# Altium schematic sheet DW1000BreakoutPeripherals.SchDoc: DecaWave DW1000
size A4; CompanyName: SPAN; Engineer: Anh Luong; Organization: University of Utah; Address1: 50 S Central Campus Dr; Address2: MEB Rm 3129; Address3: Salt Lake City, Utah 84115; Address4: USA; Revision: 1; SheetNumber: 2; SheetTotal: 2
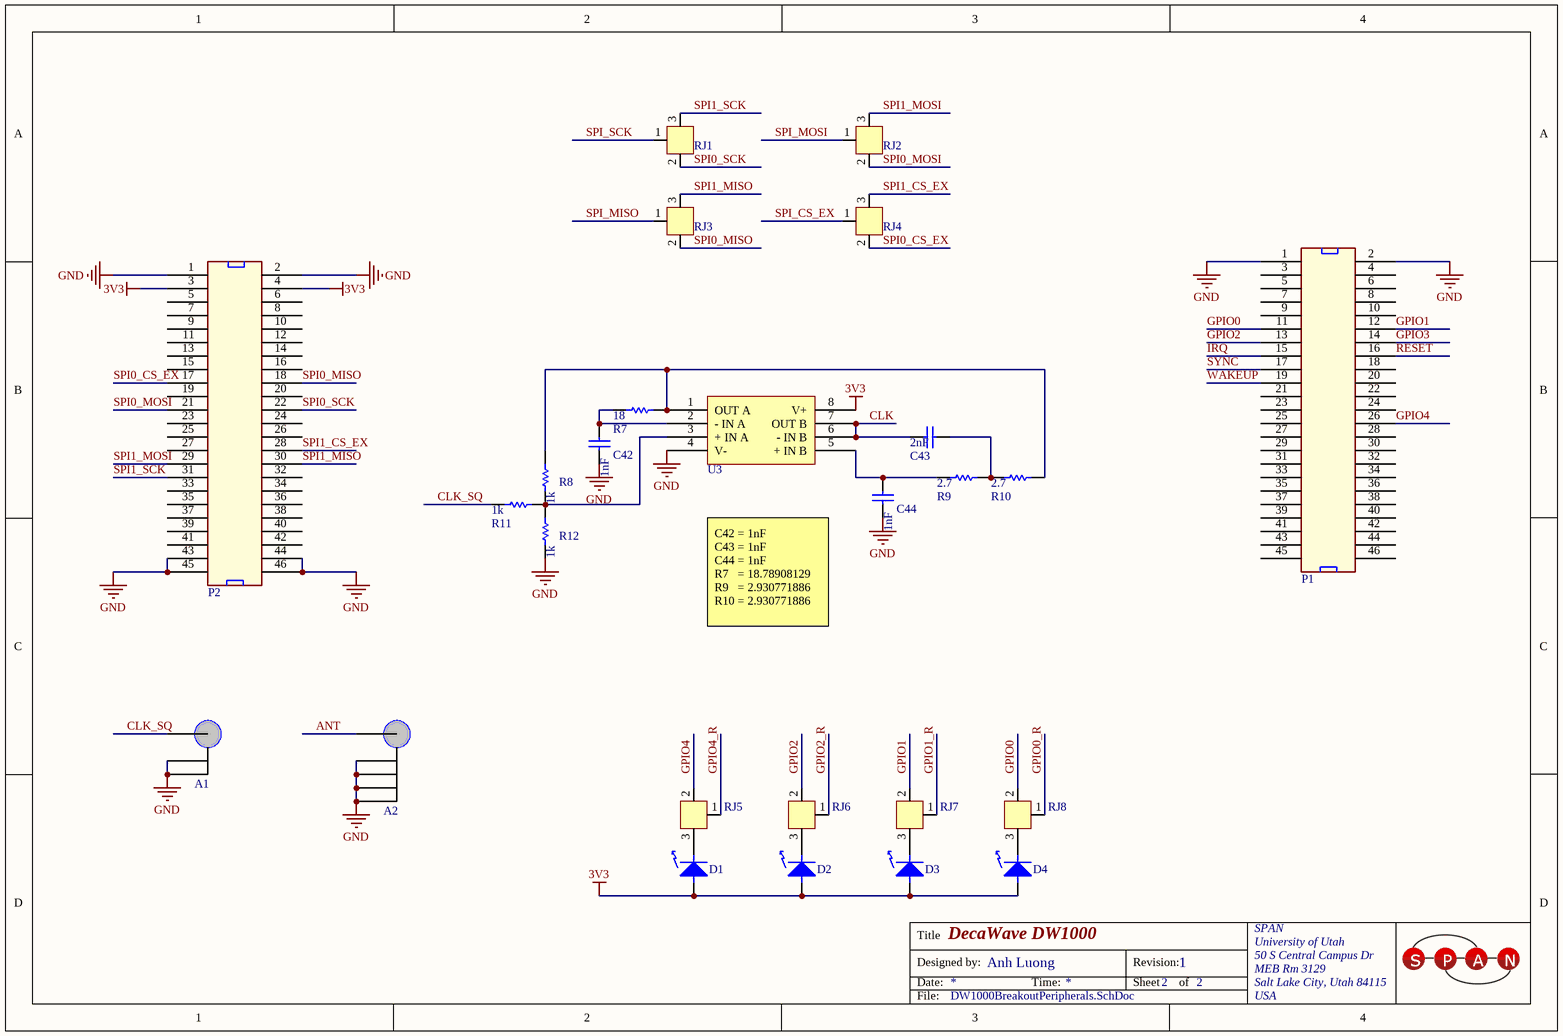
[diagram p0: DW1000BreakoutPeripherals.SchDoc]

## Parts
A1  U.FL-R-SMT(01)  [U.FL-R-SMT-1]  (value not drawn)
A2  CONSMA003.062  [SMA_EDGE_MNT]  (value not drawn)
C42  GRM033R71C102KA01D  [CAPC1608X08N (0603)]  (value not drawn)
C43  GRM1885C1H202JA01D  [CAPC1608X08N (0603)]  (value not drawn)
C44  GRM033R71C102KA01D  [CAPC1608X08N (0603)]  (value not drawn)
D1  LG Q971-KN-1  [CHIPLED0603]  (value not drawn)
D2  LG Q971-KN-1  [CHIPLED0603]  (value not drawn)
D3  LG Q971-KN-1  [CHIPLED0603]  (value not drawn)
D4  LG Q971-KN-1  [CHIPLED0603]  (value not drawn)
P1  PREC023DAAN-RC  [HEADER23X2]  (value not drawn)
P2  PREC023DAAN-RC  [HEADER23X2]  (value not drawn)
R7  MCR03ERTJ180  [RESC1608X06N (0603)]  (value not drawn)
R8  MCR03ERTJ102  [RESC1608X06N (0603)]  (value not drawn)
R9  MCR03ERTJ2R7  [RESC1608X06N (0603)]  (value not drawn)
R10  MCR03ERTJ2R7  [RESC1608X06N (0603)]  (value not drawn)
R11  MCR03ERTJ102  [RESC1608X06N (0603)]  (value not drawn)
R12  MCR03ERTJ102  [RESC1608X06N (0603)]  (value not drawn)
RJ1  R_J  [RJ]  (value not drawn)
RJ2  R_J  [RJ]  (value not drawn)
RJ3  R_J  [RJ]  (value not drawn)
RJ4  R_J  [RJ]  (value not drawn)
RJ5  R_J  [RJ]  (value not drawn)
RJ6  R_J  [RJ]  (value not drawn)
RJ7  R_J  [RJ]  (value not drawn)
RJ8  R_J  [RJ]  (value not drawn)
U3  LMV822MM/NOPB  [TSOP65P490X110-8N]  (value not drawn)

## Nets
3V3: D1.1 D2.1 D3.1 D4.1 P2.3 P2.4 U3.8(V+)
GND: A1.2 A1.3 A2.2 A2.3 A2.4 A2.5 C42.1 C44.1 P1.1 P1.2 P2.1 P2.2 P2.43 P2.44 P2.45 P2.46 R12.1 U3.4(V-)
ANT: A2.1
CLK: C43.1 U3.6(-_IN_B) U3.7(OUT_B)
CLK_SQ: A1.1 R11.1
GPIO0: P1.11 RJ8.2
GPIO0_R: RJ8.1
GPIO1: P1.12 RJ7.2
GPIO1_R: RJ7.1
GPIO2: P1.13 RJ6.2
GPIO2_R: RJ6.1
GPIO3: P1.14
GPIO4: P1.26 RJ5.2
GPIO4_R: RJ5.1
IRQ: P1.15
RESET: P1.16
SPI0_CS_EX: P2.17 RJ4.2
SPI0_MISO: P2.18 RJ3.2
SPI0_MOSI: P2.21 RJ2.2
SPI0_SCK: P2.22 RJ1.2
SPI1_CS_EX: P2.28 RJ4.3
SPI1_MISO: P2.30 RJ3.3
SPI1_MOSI: P2.29 RJ2.3
SPI1_SCK: P2.31 RJ1.3
SPI_CS_EX: RJ4.1
SPI_MISO: RJ3.1
SPI_MOSI: RJ2.1
SPI_SCK: RJ1.1
SYNC: P1.17
WAKEUP: P1.19
NetC42_2: C42.2 R7.1 U3.2(-_IN_A)
NetC43_2: C43.2 R9.2 R10.1
NetC44_2: C44.2 R9.1 U3.5(+_IN_B)
NetD1_2: D1.2 RJ5.3
NetD2_2: D2.2 RJ6.3
NetD3_2: D3.2 RJ7.3
NetD4_2: D4.2 RJ8.3
NetR7_2: R7.2 R8.2 R10.2 U3.1(OUT_A)
NetR8_1: R8.1 R11.2 R12.2 U3.3(+_IN_A)

Not connected (* = marked no-connect by the designer): P1 3(2) 4(27) 5(3) 6(28) 7(4) 8(29) 9(5) 10(30) 18(34) 20(35) 21(11) 22(36) 23(12) 24(37) 25(13) 27(14) 28(39) 29(15) 30(40) 31(16) 32(41) 33(17) 34(42) 35(18) 36(43) 37(19) 38(44) 39(20) 40(45) 41(21) 42(46) 43(22) 44(47) 45(23) 46(48); P2 5(3) 6(28) 7(4) 8(29) 9(5) 10(30) 11(6) 12(31) 13(7) 14(32) 15(8) 16(33) 19(10) 20(35) 23(12) 24(37) 25(13) 26(38) 27(14) 32(41) 33(17) 34(42) 35(18) 36(43) 37(19) 38(44) 39(20) 40(45) 41(21) 42(46)

## Notes on the sheet
- C42 = 1nF
  C43 = 1nF
  C44 = 1nF
  R7   = 18.78908129
  R9   = 2.930771886
  R10 = 2.930771886
- Title
- Designed by:
- Date:
- Time:
- Revision:
- Sheet
- of
- File:
- (in symbol GRM033R71C102KA01D) 1nF
- (in symbol GRM1885C1H202JA01D) 2nF

## Library data of the parts
A1 = U.FL-R-SMT(01): CONN UMC JACK STR 50 OHM SMD; Manufacturer: Hirose Electric Co Ltd; Connector Style: Ultra Miniature Coaxial; Connector Type: Jack, Male Pin; Contact Termination: Solder; Impedance: 50 Ohm; Frequency - Max: 6GHz; Body Material: Phosphor Bronze; Body Finish: Silver; Center Contact Plating: Gold; Dielectric Material: Liquid Crystal Polymer (LCP); Supplier 1: Digi-Key; Manufacturer Part Number: U.FL-R-SMT(01); RoHS: RoHS Compliant; Category: Connectors, Interconnects; Stock 1: 22286; Pricing 1: 1=1.28, 10=1.122, 25=1.056, 50=1.012, 100=0.968, 250=0.88, 500=0.792, 1000=0.704, 2500=0.638 (USD); Packaging: Bulk; Shield Termination: Solder; Mounting Type: Surface Mount; Cable Group: -; Fastening Type: Snap-On; Features: -; Housing Color: Silver; Ingress Protection: -; Center Contact Material: Phosphor Bronze; Voltage Rating: -; Operating Temperature: -40°C ~ 90°C; ComponentLink1URL: http://www.hirose.co.jp/cataloge_hp/e32119372.pdf; ComponentLink1Description: http://www.hirose.co.jp/cataloge_hp/e32119372.pdf
A2 = CONSMA003.062: CONN SMA JACK 50 OHM EDGE MNT; Manufacturer: Linx Technologies Inc; Connector Type: Jack, Female Socket; Contact Termination: Solder; Impedance: 50 Ohm; Body Material: Brass; Body Finish: Nickel; Center Contact Material: Beryllium Copper; Center Contact Plating: Gold; Dielectric Material: Polytetrafluoroethylene (PTFE); Supplier 1: Digi-Key; Manufacturer Part Number: CONSMA003.062; RoHS: RoHS Compliant; Category: Connectors, Interconnects; Stock 1: 6857; Pricing 1: 1=3.37, 25=3.09, 100=2.81, 500=2.6125 (USD); Packaging: Bulk; Connector Style: SMA; Shield Termination: Solder; Mounting Type: Board Edge, End Launch; Cable Group: -; Fastening Type: Threaded; Frequency - Max: -; Features: -; Housing Color: Silver; Ingress Protection: -; Voltage Rating: -; Operating Temperature: -65°C ~ 165°C; ComponentLink1URL: http://www.linxtechnologies.com/resources/diagrams/consma003.062.pdf; ComponentLink1Description: http://www.linxtechnologies.com/resources/diagrams/consma003.062.pdf
C42 C44 = GRM033R71C102KA01D: CAP CER 1000PF 16V 10% X7R 0201; Manufacturer: Murata Electronics North America; Supplier 1: Digi-Key; Manufacturer Part Number: GRM033R71C102KA01D; RoHS: RoHS Compliant; Category: Capacitors; Stock 1: 938390; Pricing 1: 1=0.1, 10=0.025, 50=0.0134, 100=0.0113, 250=0.00924, 500=0.0079, 1000=0.00615, 5000=0.00513 (USD); Packaging: Cut Tape (CT); Capacitance: 1000pF; Tolerance: ±10%; Voltage - Rated: 16V; Temperature Coefficient: X7R; Mounting Type: Surface Mount, MLCC; Operating Temperature: -55°C ~ 125°C; Applications: General Purpose; Ratings: -; Package / Case: 0201 (0603 Metric); Size / Dimension: 0.024" L x 0.012" W (0.60mm x 0.30mm); Height - Seated (Max): -; Thickness (Max): 0.013" (0.33mm); Lead Spacing: -; Features: -; Lead Style: -; ComponentLink1URL: http://search.murata.co.jp/Ceramy/image/img/A01X/G101/ENG/GRM033R71C102KA01-01.pdf; ComponentLink1Description: http://search.murata.co.jp/Ceramy/image/img/A01X/G101/ENG/GRM033R71C102KA01-01.pdf
C43 = GRM1885C1H202JA01D: CAP CER 2000PF 50V NP0 0603; Manufacturer: Murata Electronics North America; Tolerance: ±5%; Temperature Coefficient: C0G, NP0; Supplier 1: Digi-Key; Manufacturer Part Number: GRM1885C1H202JA01D; RoHS: RoHS Compliant; Category: Capacitors; Stock 1: 163868; Pricing 1: 1=0.1, 10=0.073, 50=0.0394, 100=0.0333, 250=0.02728, 500=0.02334, 1000=0.01818 (USD); Packaging: Cut Tape (CT); Part Status: Active; Capacitance: 2000pF; Voltage - Rated: 50V; Operating Temperature: -55°C ~ 125°C; Features: -; Ratings: -; Applications: General Purpose; Mounting Type: Surface Mount, MLCC; Package / Case: 0603 (1608 Metric); Size / Dimension: 0.063" L x 0.031" W (1.60mm x 0.80mm); Height - Seated (Max): -; Thickness (Max): 0.035" (0.90mm); Lead Spacing: -; Lead Style: -; ComponentLink1URL: http://www.murata.com/~/media/webrenewal/support/library/catalog/products/capacitor/mlcc/c02e.ashx; ComponentLink1Description: http://www.murata.com/~/media/webrenewal/support/library/catalog/products/capacitor/mlcc/c02e.ashx; Supplier Part Number 1: 490-1458-1-ND
D1-D4 = LG Q971-KN-1: LED CHIPLED 570NM GREEN 0603 SMD; Manufacturer: OSRAM Opto Semiconductors Inc; Wavelength - Peak: 572nm; Millicandela Rating: 10mcd; Voltage - Forward (Vf) Typ: 2.2V; Current - Test: 20mA; Viewing Angle: 160°; Lens Type: Diffused; Lens Style/Size: Rectangle with Flat Top, 1mm x 0.8mm; Supplier 1: Digi-Key; Manufacturer Part Number: LG Q971-KN-1; RoHS: RoHS Compliant; Category: Optoelectronics; Stock 1: 44000; Pricing 1: 4000=0.03632 (USD); Packaging: Tape & Reel (TR); Color: Green; Wavelength - Dominant: 570nm; Package / Case: 0603 (1608 Metric); Size / Dimension: 1.60mm L x 0.80mm W; Height: 0.80mm; Mounting Type: Surface Mount; Luminous Flux @ Current - Test: -; ComponentLink1URL: http://catalog.osram-os.com/catalogue/catalogue.do;jsessionid=DE4D071D0D2758CC117C711BF848053E?act=downloadFile&favOid=0200000600005069000100b6; ComponentLink1Description: http://catalog.osram-os.com/catalogue/catalogue.do;jsessionid=DE4D071D0D2758CC117C711BF848053E?act=downloadFile&favOid=0200000600005069000100b6
P1 P2 = PREC023DAAN-RC: CONN HEADER .100" DUAL STR 46POS; Manufacturer: Sullins Connector Solutions; Connector Type: Header, Unshrouded; Number of Positions: 46; Number of Positions Loaded: All; Pitch: 0.100" (2.54mm); Supplier 1: Digi-Key; Manufacturer Part Number: PREC023DAAN-RC; RoHS: RoHS Compliant; Category: Connectors, Interconnects; Stock 1: 0; Pricing 1: 1=0.79, 10=0.706, 100=0.5813, 500=0.45952, 1000=0.39447, 5000=0.35987, 10000=0.34603 (USD); Packaging: Bulk; Contact Type: Male Pin; Number of Rows: 2; Row Spacing: 0.100" (2.54mm); Contact Mating Length: 0.230" (5.84mm); Mounting Type: Through Hole; Termination: Solder; Fastening Type: -; Features: -; Contact Finish: Tin; Contact Finish Thickness: -; Color: Black; ComponentLink1URL: http://media.digikey.com/PDF/Data%20Sheets/Sullins%20PDFs/xRxCzzzDxxN-RC_11636-B.pdf; ComponentLink1Description: http://media.digikey.com/PDF/Data%20Sheets/Sullins%20PDFs/xRxCzzzDxxN-RC_11636-B.pdf
R7 = MCR03ERTJ180: RES SMD 18 OHM 5% 1/10W 0603; Manufacturer: Rohm Semiconductor; Resistance (Ohms): 18; Power (Watts): 0.1W, 1/10W; Temperature Coefficient: ±200ppm/°C; Supplier 1: Digi-Key; Manufacturer Part Number: MCR03ERTJ180; RoHS: RoHS Compliant; Category: Resistors; Stock 1: 8252; Pricing 1: 1=0.1, 10=0.017, 25=0.012, 50=0.0092, 100=0.0068, 250=0.00524, 500=0.00418, 1000=0.00307 (USD); Packaging: Cut Tape (CT); Part Status: Active; Tolerance: ±5%; Composition: Thick Film; Features: -; Operating Temperature: -55°C ~ 155°C; Package / Case: 0603 (1608 Metric); Supplier Device Package: 0603; Size / Dimension: 0.063" L x 0.031" W (1.60mm x 0.80mm); Height - Seated (Max): 0.022" (0.55mm); Number of Terminations: 2; Failure Rate: -; ComponentLink1URL: http://rohmfs.rohm.com/en/products/databook/datasheet/passive/resistor/chip_resistor/mcr_g.pdf; ComponentLink1Description: http://rohmfs.rohm.com/en/products/databook/datasheet/passive/resistor/chip_resistor/mcr_g.pdf; Supplier Part Number 1: RHM18CGCT-ND
R8 R11 R12 = MCR03ERTJ102: RES 1K OHM 1/10W 5% 0603 SMD; Manufacturer: Rohm Semiconductor; Power (Watts): 0.1W, 1/10W; Temperature Coefficient: ±200ppm/°C; Supplier 1: Digi-Key; Manufacturer Part Number: MCR03ERTJ102; RoHS: RoHS Compliant; Category: Resistors; Stock 1: 72962; Pricing 1: 1=0.1, 10=0.01, 25=0.0072, 100=0.0042, 250=0.00316, 500=0.00254, 1000=0.00187 (USD); Packaging: Cut Tape (CT); Resistance (Ohms): 1k; Tolerance: ±5%; Composition: Thick Film; Features: -; Operating Temperature: -55°C ~ 155°C; Package / Case: 0603 (1608 Metric); Supplier Device Package: 0603 (1608 Metric); Size / Dimension: 0.063" L x 0.031" W (1.60mm x 0.80mm); Height: 0.022" (0.55mm); Number of Terminations: 2; ComponentLink1URL: http://rohmfs.rohm.com/en/products/databook/datasheet/passive/resistor/chip_resistor/mcr_g.pdf; ComponentLink1Description: http://rohmfs.rohm.com/en/products/databook/datasheet/passive/resistor/chip_resistor/mcr_g.pdf
R9 R10 = MCR03ERTJ2R7: RES SMD 2.7 OHM 5% 1/10W 0603; Manufacturer: Rohm Semiconductor; Resistance (Ohms): 2.7; Power (Watts): 0.1W, 1/10W; Temperature Coefficient: ±400ppm/°C; Supplier 1: Digi-Key; Manufacturer Part Number: MCR03ERTJ2R7; RoHS: RoHS Compliant; Category: Resistors; Stock 1: 12955; Pricing 1: 1=0.1, 10=0.017, 25=0.012, 50=0.0092, 100=0.0068, 250=0.00524, 500=0.00418, 1000=0.00307 (USD); Packaging: Cut Tape (CT); Part Status: Active; Tolerance: ±5%; Composition: Thick Film; Features: -; Operating Temperature: -55°C ~ 155°C; Package / Case: 0603 (1608 Metric); Supplier Device Package: 0603; Size / Dimension: 0.063" L x 0.031" W (1.60mm x 0.80mm); Height - Seated (Max): 0.022" (0.55mm); Number of Terminations: 2; Failure Rate: -; ComponentLink1URL: http://rohmfs.rohm.com/en/products/databook/datasheet/passive/resistor/chip_resistor/mcr_g.pdf; ComponentLink1Description: http://rohmfs.rohm.com/en/products/databook/datasheet/passive/resistor/chip_resistor/mcr_g.pdf; Supplier Part Number 1: RHM2.7CGCT-ND
RJ1-RJ8 = R_J: Resistor Jumper; Value: DNP; Mounting Type: Surface Mount, MLCC; Applications: General Purpose; Package / Case: 0603 (1608 Metric)
U3 = LMV822MM/NOPB: Operational Amplifiers - Op Amps Low Volt Dual Op Amp; Manufacturer: Texas Instruments; Amplifier Type: General Purpose; Input Type: Rail-to-Rail; Supply Type: Single; Number of Channels: 2 Channel; Shutdown: No Shutdown; CMRR - Common Mode Rejection Ratio: 72 dB; en - Input Voltage Noise Density: 24 nV/sqrt Hz at 5 V; GBP - Gain Bandwidth Product: 5.6 MHz; Ib - Input Bias Current: 100 nA; In - Input Noise Current Density: 0.25 pA/sqrt Hz; Ios - Input Offset Current: 50 nA; Operating Supply Current: 250 uA; Operating Supply Voltage: 2.7 V, 5 V; Output Current per Channel: 45 mA; PSRR - Power Supply Rejection Ratio: 75 dB; SR - Slew Rate: 2 V/us; Supply Voltage - Max: 5.5 V; Supply Voltage - Min: 2.5 V; Voltage Gain dB: 105 dB; Vos - Input Offset Voltage: 3.5 mV; Supplier 1: Mouser; Manufacturer Part Number: LMV822MM/NOPB; RoHS: RoHS Compliant; Category: Operational Amplifiers - Op Amps; Stock 1: 1996; Pricing 1: 1=1.40, 10=1.26, 25=1.16, 50=1.04, 100=0.984, 250=0.920, 500=0.813, 1000=0.535 (USD); Height: 0.86 mm; Length: 3 mm; Output Type: Rail-to-Rail; Package / Case: MSOP-8; Packaging: Reel; Product: Operational Amplifiers; Series: LMV822-N; Width: 3 mm; Brand: Texas Instruments; Mounting Style: SMD/SMT; Maximum Operating Temperature: + 85 C; Minimum Operating Temperature: - 40 C; Standard Pack Qty: 1000; RoHS - Mouser: Y; Minimum Order Quantity: 1; Reeling: True; Supplier Part Number 1: 926-LMV822MM/NOPB